# EAGLE schematic switch_AT10 (EAGLE 9.3.1)
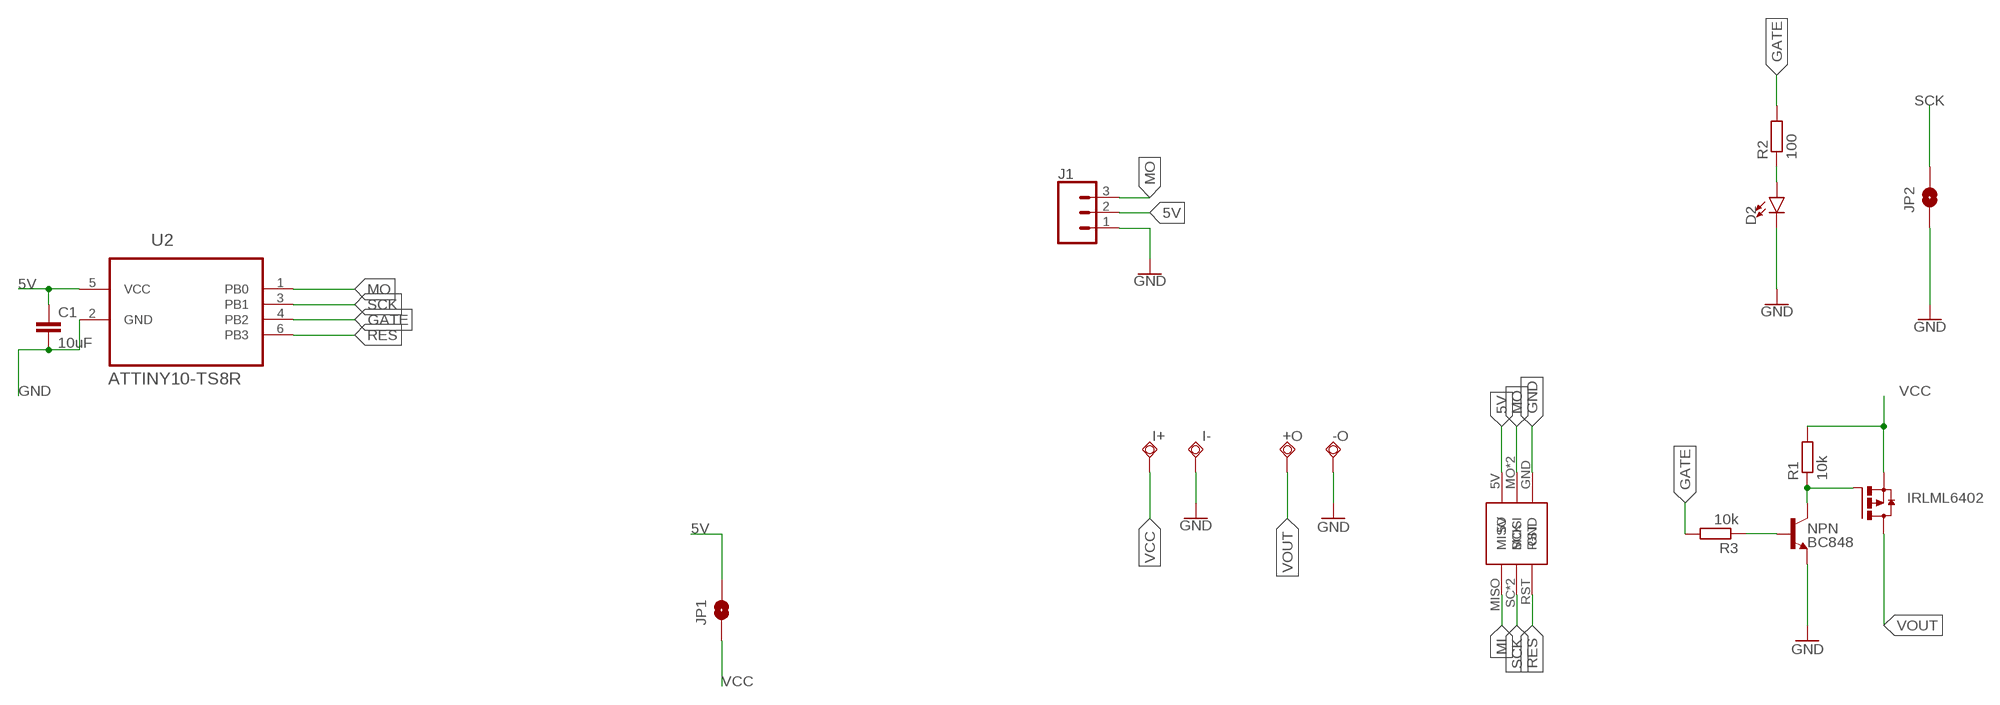
[diagram p0: schematic, sheet 1]

## Parts
+O  TPSQTP20SQ  [TP20SQ]
-O  TPSQTP20SQ  [TP20SQ]
C1  10uF  C-EUC0603K  [C0603K]
D2  LED0603  [LED-0603]
I+  TPSQTP20SQ  [TP20SQ]
I-  TPSQTP20SQ  [TP20SQ]
IRLML6402  FDN360P  [SUPER-SOT3]
J1  CONN_03  [1X03]
JP1  JUMPER-SMT_2_NO_NO-SILK  [SMT-JUMPER_2_NO_NO-SILK]
JP2  JUMPER-SMT_2_NO_NO-SILK  [SMT-JUMPER_2_NO_NO-SILK]
NPN  BC848  TRANS_NPN-MMBT2222AL  [SOT23-3]
R1  10k  R-EU_R0603  [R0603]
R2  100  R-EU_R0603  [R0603]
R3  10k  R-EU_R0603  [R0603]
U2  ATTINY10-TS8R  [SOT95P280X145-6N]
U$2  ISCP_PORTPOGONEW  [ISCP_PADS_2ROW2HNEW]

## Nets
5V: C1.1 J1.2 JP1.2 U2.5(VCC) U$2.5V
GATE: R2.2 R3.2 U2.4(PB2)
GND: -O.TP C1.2 D2.C I-.TP J1.1 JP2.1 NPN.2(E) U2.2(GND) U$2.GND
MI: U$2.MISO
MO: J1.3 U2.1(PB0) U$2.MO(MOSI) U$2.MOSI
N$1: NPN.1(B) R3.1
N$4: D2.A R2.1
NN: IRLML6402.1(G) NPN.3(C) R1.1
RES: U2.6(PB3) U$2.RST
SCK: JP2.2 U2.3(PB1) U$2.SC(SCK) U$2.SCK
VCC [vcc]: I+.TP IRLML6402.2(S) JP1.1 R1.2
VOUT [vcc]: +O.TP IRLML6402.3(D)

## Library data of the parts
+O -O I+ I- = testpad:TPSQ: Test pad
C1 = rcl:C-EU: CAPACITOR, European symbol; SPICEPREFIX: C
D2 = SparkFun-LED:LED: LED (Generic) Standard schematic elements and footprints for 5mm, 3mm, 1206, and 0603 sized LEDs. Generic LEDs with no color specified.
IRLML6402 = transistor-power:FDN360P: Single P-Channel, PowerTrench (R) MOSFET Source: http://www.fairchildsemi.com/ds/FD/FDN360P.pdf
J1 = SparkFun-Connectors:CONN_03: Multi connection point. Often used as Generic Header-pin footprint for 0.1 inch spaced/style header connections On any of the 0.1 inch spaced packages, you can populate with these: Break Away Headers - Straight <https://www.sparkfun.com/products/116> (PRT-00116) Break Away Male Headers - Right Angle <https://www.sparkfun.com/products/553> (PRT-00553) Female Headers <https://www.sparkfun.com/products/115> (PRT-00115) Break Away Headers - Machine Pin <https://www.sparkfun.com/products/117> (PRT-00117) Break Away Female Headers - Swiss Machine Pin <https://www.sparkfun.com/products/743> (PRT-00743) Stackable Header - 3 Pin (Female, 0.1") <https://www.sparkfun.com/products/13875> (PRT-13875) For SCREWTERMINALS and SPRING TERMINALS visit here: Screw Terimnals on SparkFun.com <https://www.sparkfun.com/search/results?term=Screw+Terminals> (5mm/3.5mm/2.54mm spacing) This device is also useful as a general connection point to wire up your design to another part of your project. Our various solder wires solder well into these plated through hole pads. Hook-Up Wire - Assortment (Stranded, 22 AWG) <https://www.sparkfun.com/products/11375> (PRT-11375) Hook-Up Wire - Assortment (Solid Core, 22 AWG) <https://www.sparkfun.com/products/11367> (PRT-11367) View the entire wire category on our website here <https://www.sparkfun.com/categories/141> Special notes: Molex polarized connector foot print use with SKU : PRT-08232 with associated crimp pins and housings.
JP1 JP2 = SparkFun-Jumpers:JUMPER-SMT_2_NO: Normally open jumper This jumper has two pads in close proximity to each other. Apply solder to close the connection. Round pads are easier to solder for beginners, but are a lot larger. SparkFun Product that uses the round pads: SparkFun EL Sequencer <https://www.sparkfun.com/products/12781>
NPN = SparkFun-DiscreteSemi:TRANS_NPN: NPN transistor Current controlled devices typically used to amplify current or used as a switch. BC547 - COM-08928 <http://www.sparkfun.com/products/8928> (TO-92 45V 100mA) (1.Collector 2.Base 3.Emitter) 2N3904 - COM-00521 <http://www.sparkfun.com/products/521> (TO-92 40V 200mA) (1.Emitter 2.Base 3.Collector) P2N2222A - COM-12852 <http://www.sparkfun.com/products/12852> (TO-92 40V 600mA) (1.Collector 2.Base 3.Emitter); PROD_ID: TRANS-08049; VALUE: 600mA/40V
R1-R3 = rcl:R-EU_: RESISTOR, European symbol; SPICEPREFIX: R
U2 = ATTINY10-TS8R:ATTINY10-TS8R: 8-bit Microcontroller with In-System Programmable Flash; AVAILABILITY: Unavailable; DESCRIPTION: Embedded microcontroller ATTINY10-TS8R SOT 23 Microchip Technology 8-Bit 10 MHz I/O number 4; MF: Microchip; MP: ATTINY10-TS8R; PACKAGE: SOT-23-6 Microchip; PRICE: None
U$2 = CoreDuino:ISCP_PORT

## Net classes
0 default: width 0.2 mm, clearance 0.2 mm
1 vcc: width 0.5 mm, clearance 0.381 mm